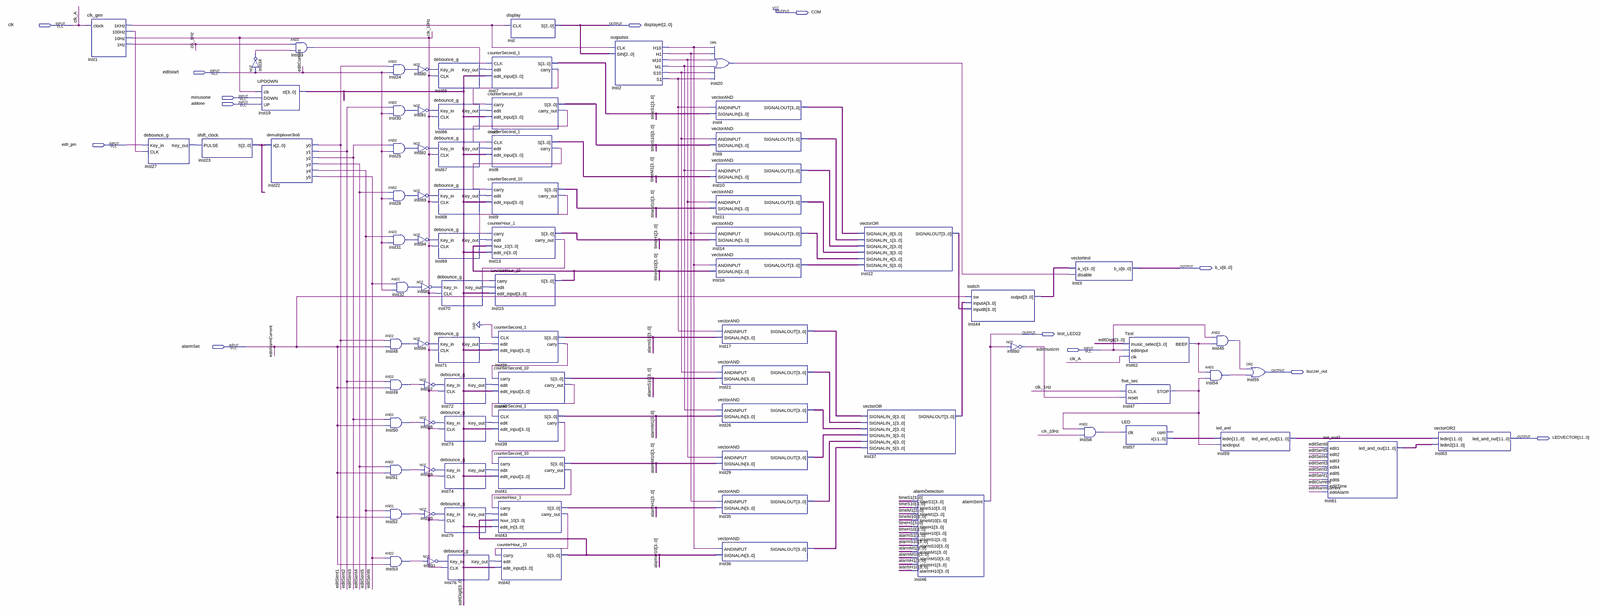
[diagram p0: schematic sheet, whole]
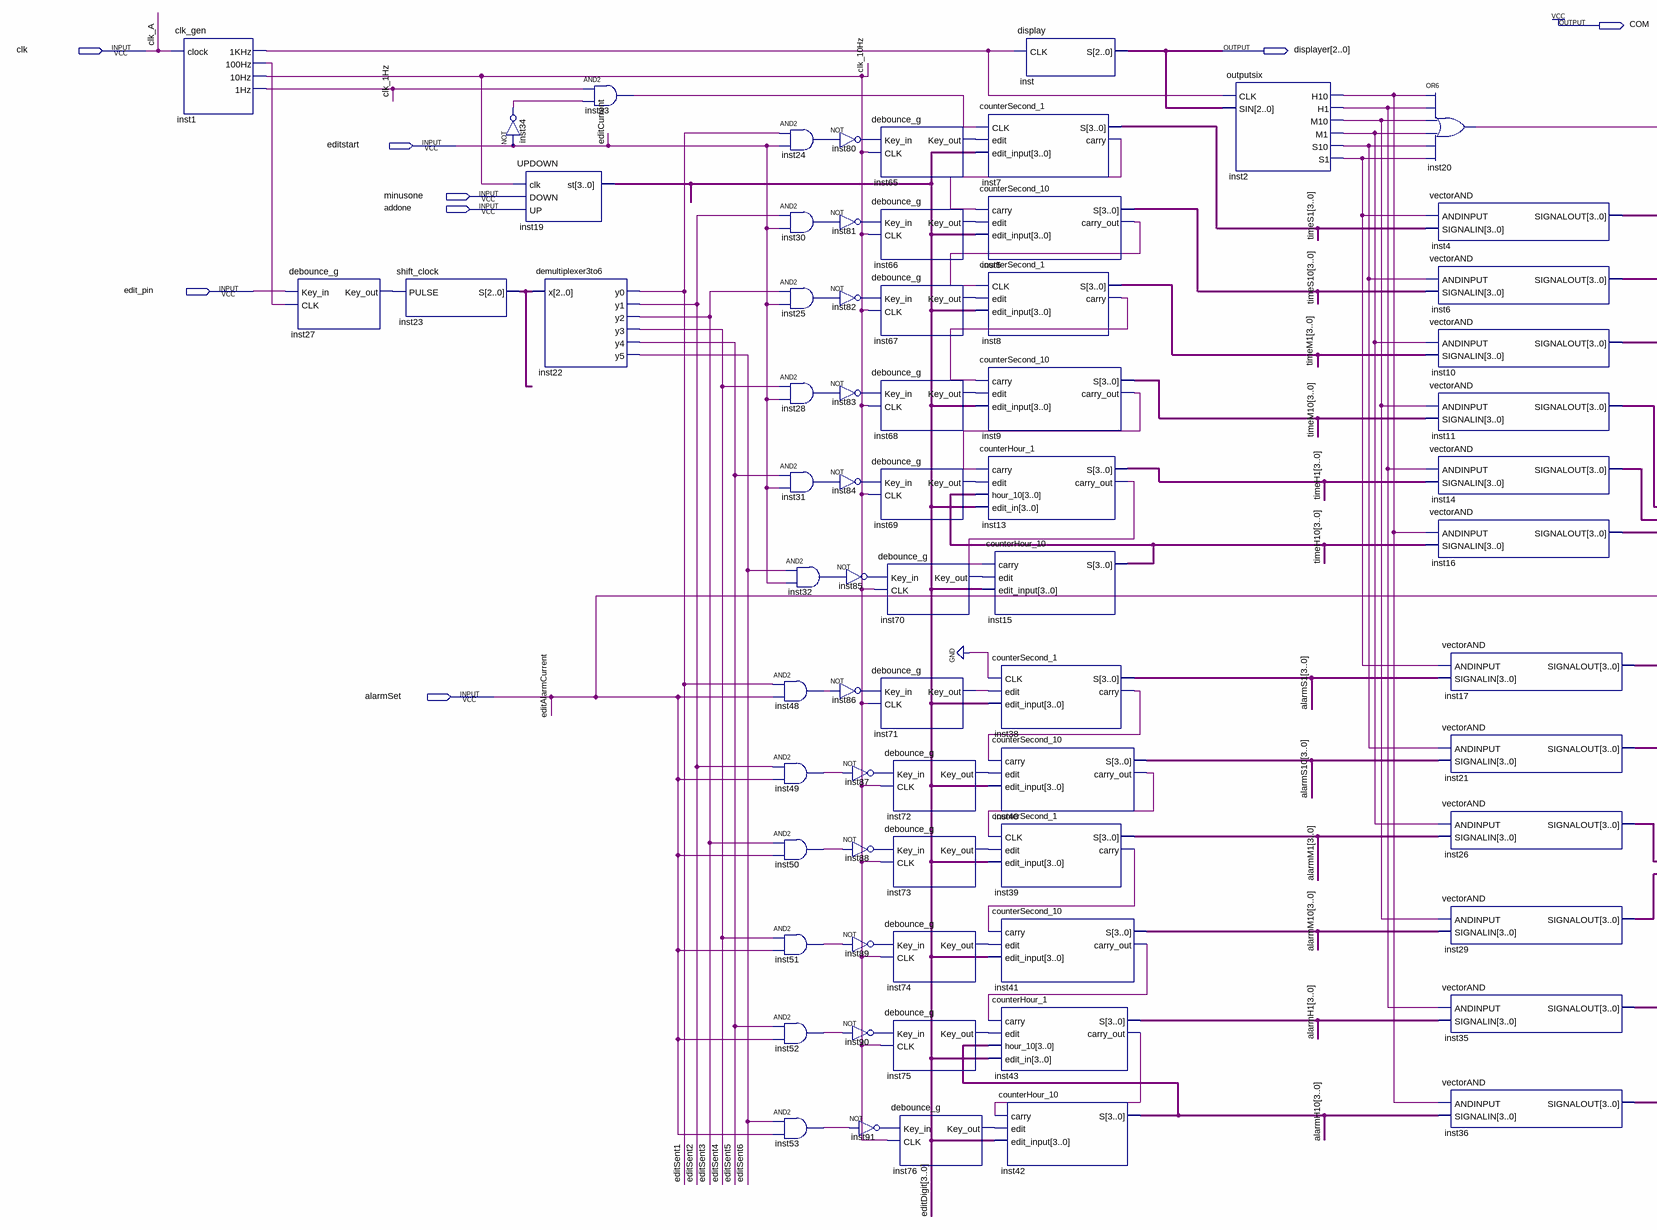
[diagram p1: schematic sheet, left part]
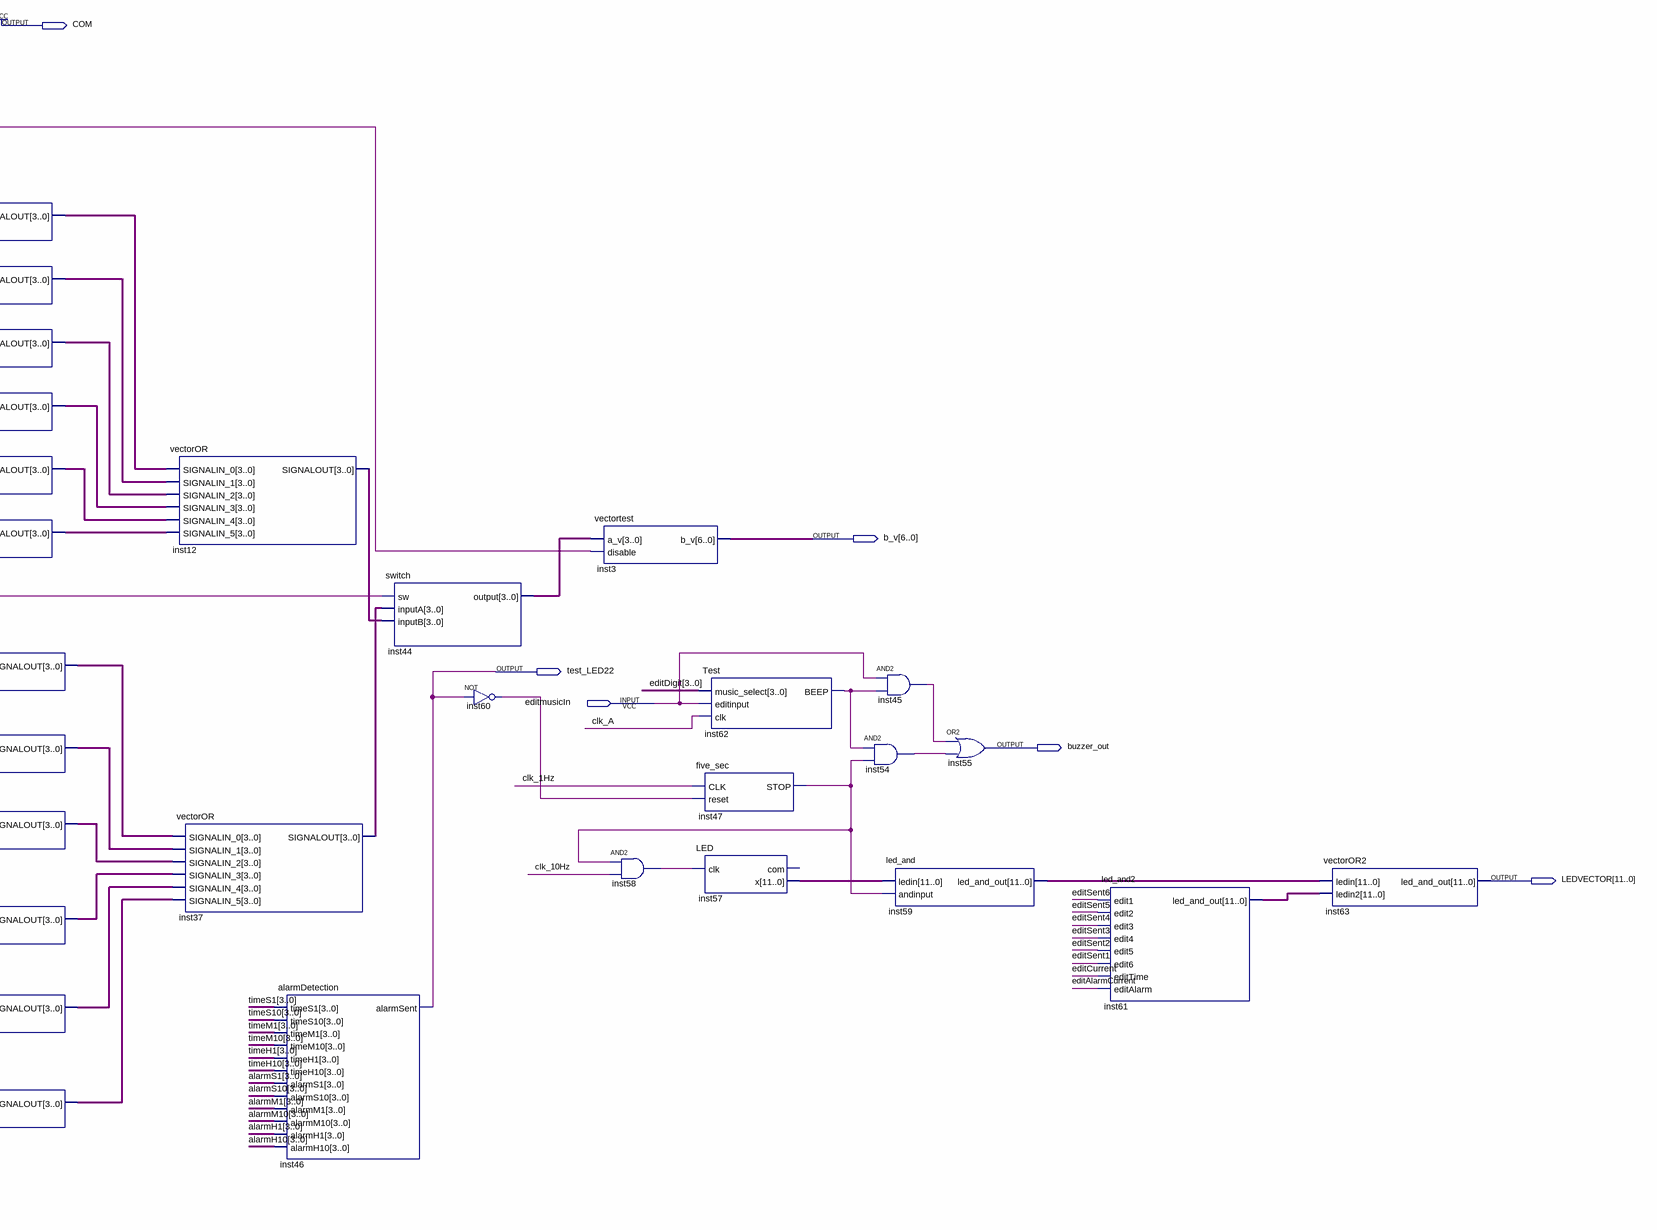
[diagram p2: schematic sheet, right part]
// Quartus schematic projectClock.bdf as structural Verilog: 86 symbols, 13 pins
module projectClock (
  input  clk,
  input  editstart,
  input  minusone,
  input  addone,
  input  edit_pin,
  input  alarmSet,
  input  editmusicIn,
  output COM,
  output [2:0] displayer,
  output [6:0] b_v,
  output test_LED22,
  output buzzer_out,
  output [11:0] LEDVECTOR
);

  wire clk_1Hz, clk_10Hz, editSent1, editSent2, editSent3, editSent4, editSent5, editSent6, inst1_1khz,
       inst1_100hz, inst2_h1, inst2_h10, inst2_m1, inst2_m10, inst2_s1, inst2_s10, inst5_carry_out,
       inst7_carry, inst8_carry, inst9_carry_out, inst13_carry_out, inst20_out, inst24_out, inst25_out,
       inst27_key_out, inst28_out, inst30_out, inst31_out, inst32_out, inst33_out, inst34_out, inst38_carry,
       inst39_carry, inst40_carry_out, inst41_carry_out, inst43_carry_out, inst45_out, inst47_stop,
       inst48_out, inst49_out, inst50_out, inst51_out, inst52_out, inst53_out, inst54_out, inst58_out,
       inst60_out, inst62_beep, inst65_key_out, inst66_key_out, inst67_key_out, inst68_key_out,
       inst69_key_out, inst70_key_out, inst71_key_out, inst72_key_out, inst73_key_out, inst74_key_out,
       inst75_key_out, inst76_key_out, inst80_out, inst81_out, inst82_out, inst83_out, inst84_out,
       inst85_out, inst86_out, inst87_out, inst88_out, inst89_out, inst90_out, inst91_out;
  wire [2:0] inst23_s;
  wire [3:0] alarmH1, alarmH10, alarmM1, alarmM10, alarmS1, alarmS10, editDigit, inst4_signalout,
       inst6_signalout, inst10_signalout, inst11_signalout, inst12_signalout, inst14_signalout,
       inst16_signalout, inst17_signalout, inst21_signalout, inst26_signalout, inst29_signalout,
       inst35_signalout, inst36_signalout, inst37_signalout, inst44_output, timeH1, timeH10, timeM1, timeM10,
       timeS1, timeS10;
  wire [11:0] inst57_x, inst59_led_and_out, inst61_led_and_out;

  clk_gen inst1 (.clock(clk), .\1KHz (inst1_1khz), .\100Hz (inst1_100hz), .\10Hz (clk_10Hz), .\1Hz (clk_1Hz));
  debounce_g inst27 (.Key_in(edit_pin), .CLK(inst1_100hz), .Key_out(inst27_key_out));
  shift_clock inst23 (.PULSE(inst27_key_out), .S(inst23_s));
  not inst34 (inst34_out, editstart);
  UPDOWN inst19 (.clk(clk_10Hz), .DOWN(minusone), .UP(addone), .st(editDigit));
  demultiplexer3to6 inst22 (
    .x(inst23_s), .y0(editSent1), .y1(editSent2), .y2(editSent3), .y3(editSent4), .y4(editSent5),
    .y5(editSent6));
  and inst33 (inst33_out, clk_1Hz, inst34_out);
  and inst24 (inst24_out, editSent1, editstart);
  and inst30 (inst30_out, editSent2, editstart);
  and inst25 (inst25_out, editSent3, editstart);
  and inst28 (inst28_out, editSent4, editstart);
  and inst31 (inst31_out, editSent5, editstart);
  and inst32 (inst32_out, editSent6, editstart);
  and inst48 (inst48_out, editSent1, alarmSet);
  and inst49 (inst49_out, editSent2, alarmSet);
  and inst50 (inst50_out, editSent3, alarmSet);
  and inst51 (inst51_out, editSent4, alarmSet);
  and inst52 (inst52_out, editSent5, alarmSet);
  and inst53 (inst53_out, editSent6, alarmSet);
  not inst80 (inst80_out, inst24_out);
  not inst81 (inst81_out, inst30_out);
  not inst82 (inst82_out, inst25_out);
  not inst83 (inst83_out, inst28_out);
  not inst84 (inst84_out, inst31_out);
  not inst85 (inst85_out, inst32_out);
  not inst86 (inst86_out, inst48_out);
  not inst87 (inst87_out, inst49_out);
  not inst88 (inst88_out, inst50_out);
  not inst89 (inst89_out, inst51_out);
  not inst90 (inst90_out, inst52_out);
  not inst91 (inst91_out, inst53_out);
  debounce_g inst65 (.Key_in(inst80_out), .CLK(clk_10Hz), .Key_out(inst65_key_out));
  debounce_g inst66 (.Key_in(inst81_out), .CLK(clk_10Hz), .Key_out(inst66_key_out));
  debounce_g inst67 (.Key_in(inst82_out), .CLK(clk_10Hz), .Key_out(inst67_key_out));
  debounce_g inst68 (.Key_in(inst83_out), .CLK(clk_10Hz), .Key_out(inst68_key_out));
  debounce_g inst69 (.Key_in(inst84_out), .CLK(clk_10Hz), .Key_out(inst69_key_out));
  debounce_g inst70 (.Key_in(inst85_out), .CLK(clk_10Hz), .Key_out(inst70_key_out));
  debounce_g inst71 (.Key_in(inst86_out), .CLK(clk_10Hz), .Key_out(inst71_key_out));
  debounce_g inst72 (.Key_in(inst87_out), .CLK(clk_10Hz), .Key_out(inst72_key_out));
  debounce_g inst73 (.Key_in(inst88_out), .CLK(clk_10Hz), .Key_out(inst73_key_out));
  debounce_g inst74 (.Key_in(inst89_out), .CLK(clk_10Hz), .Key_out(inst74_key_out));
  debounce_g inst75 (.Key_in(inst90_out), .CLK(clk_10Hz), .Key_out(inst75_key_out));
  debounce_g inst76 (.Key_in(inst91_out), .CLK(clk_10Hz), .Key_out(inst76_key_out));
  display inst (.CLK(inst1_1khz), .S(displayer));
  counterSecond_1 inst7 (
    .CLK(inst33_out), .edit(inst65_key_out), .edit_input(editDigit), .S(timeS1), .carry(inst7_carry));
  counterSecond_10 inst5 (
    .carry(inst7_carry), .edit(inst66_key_out), .edit_input(editDigit), .S(timeS10),
    .carry_out(inst5_carry_out));
  counterSecond_1 inst8 (
    .CLK(inst5_carry_out), .edit(inst67_key_out), .edit_input(editDigit), .S(timeM1), .carry(inst8_carry));
  counterSecond_10 inst9 (
    .carry(inst8_carry), .edit(inst68_key_out), .edit_input(editDigit), .S(timeM10),
    .carry_out(inst9_carry_out));
  counterHour_1 inst13 (
    .carry(inst9_carry_out), .edit(inst69_key_out), .hour_10(timeH10), .edit_in(editDigit), .S(timeH1),
    .carry_out(inst13_carry_out));
  counterHour_10 inst15 (.carry(inst13_carry_out), .edit(inst70_key_out), .edit_input(editDigit), .S(timeH10));
  counterSecond_1 inst38 (.CLK(1'b0), .edit(inst71_key_out), .edit_input(editDigit), .S(alarmS1), .carry(inst38_carry));
  counterSecond_10 inst40 (
    .carry(inst38_carry), .edit(inst72_key_out), .edit_input(editDigit), .S(alarmS10),
    .carry_out(inst40_carry_out));
  counterSecond_1 inst39 (
    .CLK(inst40_carry_out), .edit(inst73_key_out), .edit_input(editDigit), .S(alarmM1), .carry(inst39_carry));
  counterSecond_10 inst41 (
    .carry(inst39_carry), .edit(inst74_key_out), .edit_input(editDigit), .S(alarmM10),
    .carry_out(inst41_carry_out));
  counterHour_1 inst43 (
    .carry(inst41_carry_out), .edit(inst75_key_out), .hour_10(alarmH10), .edit_in(editDigit), .S(alarmH1),
    .carry_out(inst43_carry_out));
  counterHour_10 inst42 (.carry(inst43_carry_out), .edit(inst76_key_out), .edit_input(editDigit), .S(alarmH10));
  outputsix inst2 (
    .CLK(inst1_1khz), .SIN(displayer), .H10(inst2_h10), .H1(inst2_h1), .M10(inst2_m10), .M1(inst2_m1),
    .S10(inst2_s10), .S1(inst2_s1));
  or inst20 (inst20_out, inst2_h10, inst2_h1, inst2_m10, inst2_m1, inst2_s10, inst2_s1);
  vectorAND inst4 (.ANDINPUT(inst2_s1), .SIGNALIN(timeS1), .SIGNALOUT(inst4_signalout));
  vectorAND inst6 (.ANDINPUT(inst2_s10), .SIGNALIN(timeS10), .SIGNALOUT(inst6_signalout));
  vectorAND inst10 (.ANDINPUT(inst2_m1), .SIGNALIN(timeM1), .SIGNALOUT(inst10_signalout));
  vectorAND inst11 (.ANDINPUT(inst2_m10), .SIGNALIN(timeM10), .SIGNALOUT(inst11_signalout));
  vectorAND inst14 (.ANDINPUT(inst2_h1), .SIGNALIN(timeH1), .SIGNALOUT(inst14_signalout));
  vectorAND inst16 (.ANDINPUT(inst2_h10), .SIGNALIN(timeH10), .SIGNALOUT(inst16_signalout));
  vectorAND inst17 (.ANDINPUT(inst2_s1), .SIGNALIN(alarmS1), .SIGNALOUT(inst17_signalout));
  vectorAND inst21 (.ANDINPUT(inst2_s10), .SIGNALIN(alarmS10), .SIGNALOUT(inst21_signalout));
  vectorAND inst26 (.ANDINPUT(inst2_m1), .SIGNALIN(alarmM1), .SIGNALOUT(inst26_signalout));
  vectorAND inst29 (.ANDINPUT(inst2_m10), .SIGNALIN(alarmM10), .SIGNALOUT(inst29_signalout));
  vectorAND inst35 (.ANDINPUT(inst2_h1), .SIGNALIN(alarmH1), .SIGNALOUT(inst35_signalout));
  vectorAND inst36 (.ANDINPUT(inst2_h10), .SIGNALIN(alarmH10), .SIGNALOUT(inst36_signalout));
  vectorOR inst12 (
    .SIGNALIN_0(inst4_signalout), .SIGNALIN_1(inst6_signalout), .SIGNALIN_2(inst10_signalout),
    .SIGNALIN_3(inst11_signalout), .SIGNALIN_4(inst14_signalout), .SIGNALIN_5(inst16_signalout),
    .SIGNALOUT(inst12_signalout));
  vectorOR inst37 (
    .SIGNALIN_0(inst17_signalout), .SIGNALIN_1(inst21_signalout), .SIGNALIN_2(inst26_signalout),
    .SIGNALIN_3(inst29_signalout), .SIGNALIN_4(inst35_signalout), .SIGNALIN_5(inst36_signalout),
    .SIGNALOUT(inst37_signalout));
  alarmDetection inst46 (
    .timeS1(timeS1), .timeS10(timeS10), .timeM1(timeM1), .timeM10(timeM10), .timeH1(timeH1),
    .timeH10(timeH10), .alarmS1(alarmS1), .alarmS10(alarmS10), .alarmM1(alarmM1), .alarmM10(alarmM10),
    .alarmH1(alarmH1), .alarmH10(alarmH10), .alarmSent(test_LED22));
  switch inst44 (.sw(alarmSet), .inputA(inst37_signalout), .inputB(inst12_signalout), .\output (inst44_output));
  not inst60 (inst60_out, test_LED22);
  vectortest inst3 (.a_v(inst44_output), .\disable (inst20_out), .b_v(b_v));
  and inst58 (inst58_out, inst47_stop, clk_10Hz);
  Test inst62 (.music_select(editDigit), .editinput(editmusicIn), .clk(clk), .BEEP(inst62_beep));
  five_sec inst47 (.CLK(clk_1Hz), .reset(inst60_out), .STOP(inst47_stop));
  LED inst57 (.clk(inst58_out), .x(inst57_x));  // open: com
  and inst45 (inst45_out, editmusicIn, inst62_beep);
  and inst54 (inst54_out, inst62_beep, inst47_stop);
  led_and inst59 (.ledin(inst57_x), .andinput(inst47_stop), .led_and_out(inst59_led_and_out));
  or inst55 (buzzer_out, inst45_out, inst54_out);
  led_and2 inst61 (
    .edit1(editSent6), .edit2(editSent5), .edit3(editSent4), .edit4(editSent3), .edit5(editSent2),
    .edit6(editSent1), .editTime(editstart), .editAlarm(alarmSet), .led_and_out(inst61_led_and_out));
  vectorOR2 inst63 (.ledin(inst59_led_and_out), .ledin2(inst61_led_and_out), .led_and_out(LEDVECTOR));

  assign COM = 1'b1;

  // Other names for the same wires on the sheet: editAlarmCurrent = alarmSet; clk_A = clk; editCurrent = editstart
endmodule
